# Altium schematic sheet Filter.SchDoc: Filter
size A4; Author: Robin Geißler; CompanyName: Fraunhofer EMFT; DrawnBy: Robin Geißler; Revision: 1.1.; SheetNumber: 5; SheetTotal: 6
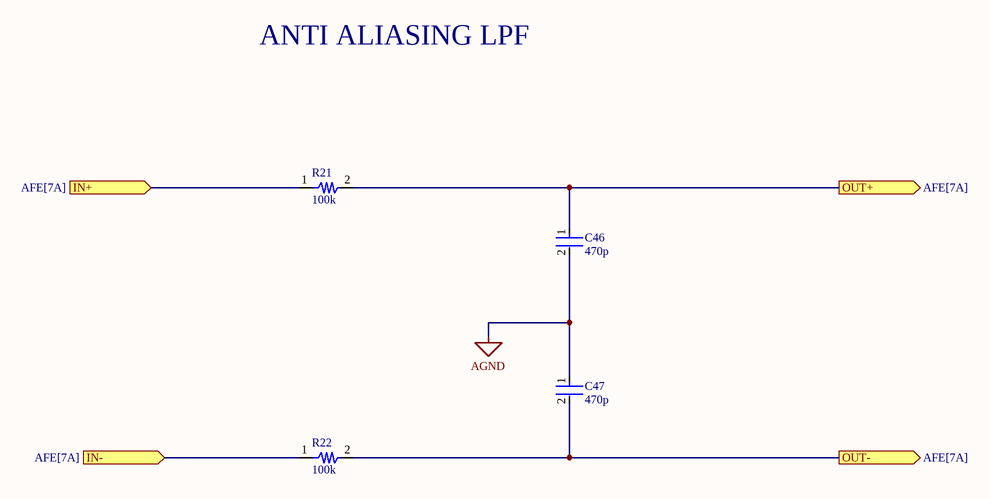
[diagram p0: Filter.SchDoc]

## Parts
C46  470p  [FP-C0603C-CF-MFG]
C47  470p  [FP-C0603C-CF-MFG]
R21  100k  [R-1608 [0603]-M]
R22  100k  [R-1608 [0603]-M]

## Ports
IN+ (in, see AFE[7A]), IN- (in, see AFE[7A]), OUT+ (out, see AFE[7A]), OUT- (out, see AFE[7A])

## Nets
AGND: C46.2 C47.1
IN+: R21.1 ; port IN+
IN-: R22.1 ; port IN-
OUT+: C46.1 R21.2 ; port OUT+
OUT-: C47.2 R22.2 ; port OUT-

## Notes on the sheet
- ANTI ALIASING LPF

## Library data of the parts
C46 C47 = CMP-1035-01678-2: C0603 470 pF C0G 30ppm/°C 1.00% 100 V; Manufacturer: KEMET; Manufacturer Part Number: C0603C471F1GACTU; Material: Ceramic; Automotive Grade: Grade 1; Voltage Rating: 100 V; Capacitance: 470 pF; Value: 470 pF; Tolerance: 0.01; RoHS: TRUE; Lead Free: Yes; Category: Cap; ComponentLink2Description: Datasheet; Temperature Range Low: -55°C; Temperature: -55°C to +125°C; Mouser Description: Multilayer Ceramic Capacitors MLCC - SMD/SMT 100volts 470pF 1% C0G; Device Class L2: Capacitors; Octopart: https://octopart.com/c0603c471f1gactu-kemet-26647159; Device Class L3: Ceramic Capacitors; Temperature Characteristic: C0G; Device Class L1: Passive Components; Temperature Coefficient: 30ppm/°C; Temperature Range High: +125°C; ComponentLink2URL: https://api.kemet.com/component-edge/download/datasheet/C0603C100J5GACAUTO.pdf; Automotive: Yes; Package: C0603C-CF; Height: 0.87mm
R21 R22 = Precision_Resistor: Expensive: P2TC0603D1003LNTA - 0.01% Cheap: TNPU0603100KAYEN00 - 0.05%; Supplier 1: Rs; Supplier Part Number 1: 2182743P; Supplier 2: Arrow Electronics; Supplier Part Number 2: TNPU0603100KAYEN00